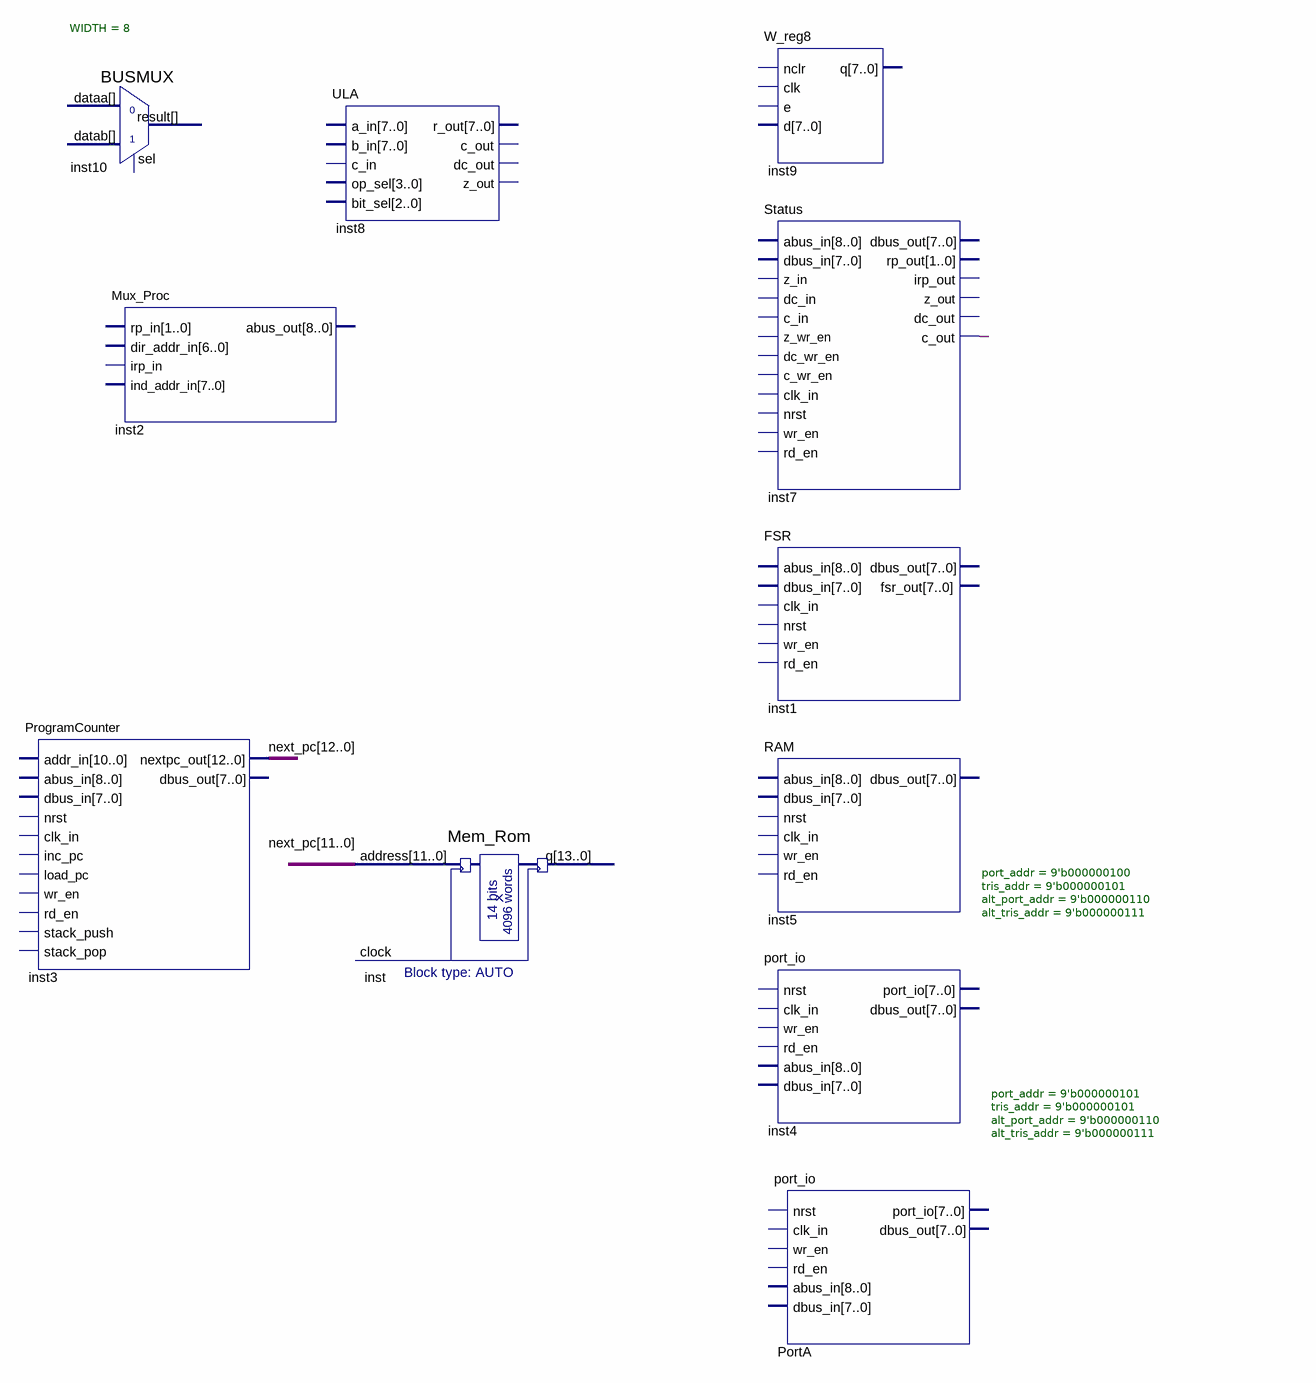
[diagram p0: schematic sheet]
// Quartus schematic Processador.bdf as structural Verilog: 11 symbols, 0 pins
module Processador (
);

  wire inst7_c_out;
  wire [12:0] next_pc;

  BUSMUX #(.WIDTH(8)) inst10 ();  // open: datab, sel, dataa, result
  ProgramCounter inst3 (.nextpc_out(next_pc));  // open: addr_in, abus_in, dbus_in, nrst, clk_in, inc_pc, load_pc, wr_en, rd_en, stack_push, stack_pop, dbus_out
  Mux_Proc inst2 ();  // open: rp_in, dir_addr_in, irp_in, ind_addr_in, abus_out
  ULA inst8 ();  // open: a_in, b_in, c_in, op_sel, bit_sel, r_out, c_out, dc_out, z_out
  Mem_Rom inst (.address(next_pc[11:0]));  // open: clock, q
  W_reg8 inst9 ();  // open: nclr, clk, e, d, q
  Status inst7 (.c_out(inst7_c_out));  // open: abus_in, dbus_in, z_in, dc_in, c_in, z_wr_en, dc_wr_en, c_wr_en, clk_in, nrst, wr_en, rd_en, dbus_out, rp_out, irp_out, z_out, dc_out
  FSR inst1 ();  // open: abus_in, dbus_in, clk_in, nrst, wr_en, rd_en, dbus_out, fsr_out
  RAM inst5 ();  // open: abus_in, dbus_in, nrst, clk_in, wr_en, rd_en, dbus_out
  port_io #(.port_addr(9'b000000100), .tris_addr(9'b000000101), .alt_port_addr(9'b000000110), .alt_tris_addr(9'b000000111)) inst4 ();  // open: nrst, clk_in, wr_en, rd_en, abus_in, dbus_in, dbus_out, port_io
  port_io #(.port_addr(9'b000000101), .tris_addr(9'b000000101), .alt_port_addr(9'b000000110), .alt_tris_addr(9'b000000111)) PortA ();  // open: nrst, clk_in, wr_en, rd_en, abus_in, dbus_in, dbus_out, port_io
endmodule
